# Altium schematic sheet 4_Load_Cell_Acquisition.SchDoc
size A3; Organization: Altium Limited; Address1: L3, 12a Rodborough Rd; Address2: Frenchs Forest; Address3: NSW; Address4: Australia 2086; SheetNumber: 4; SheetTotal: 8
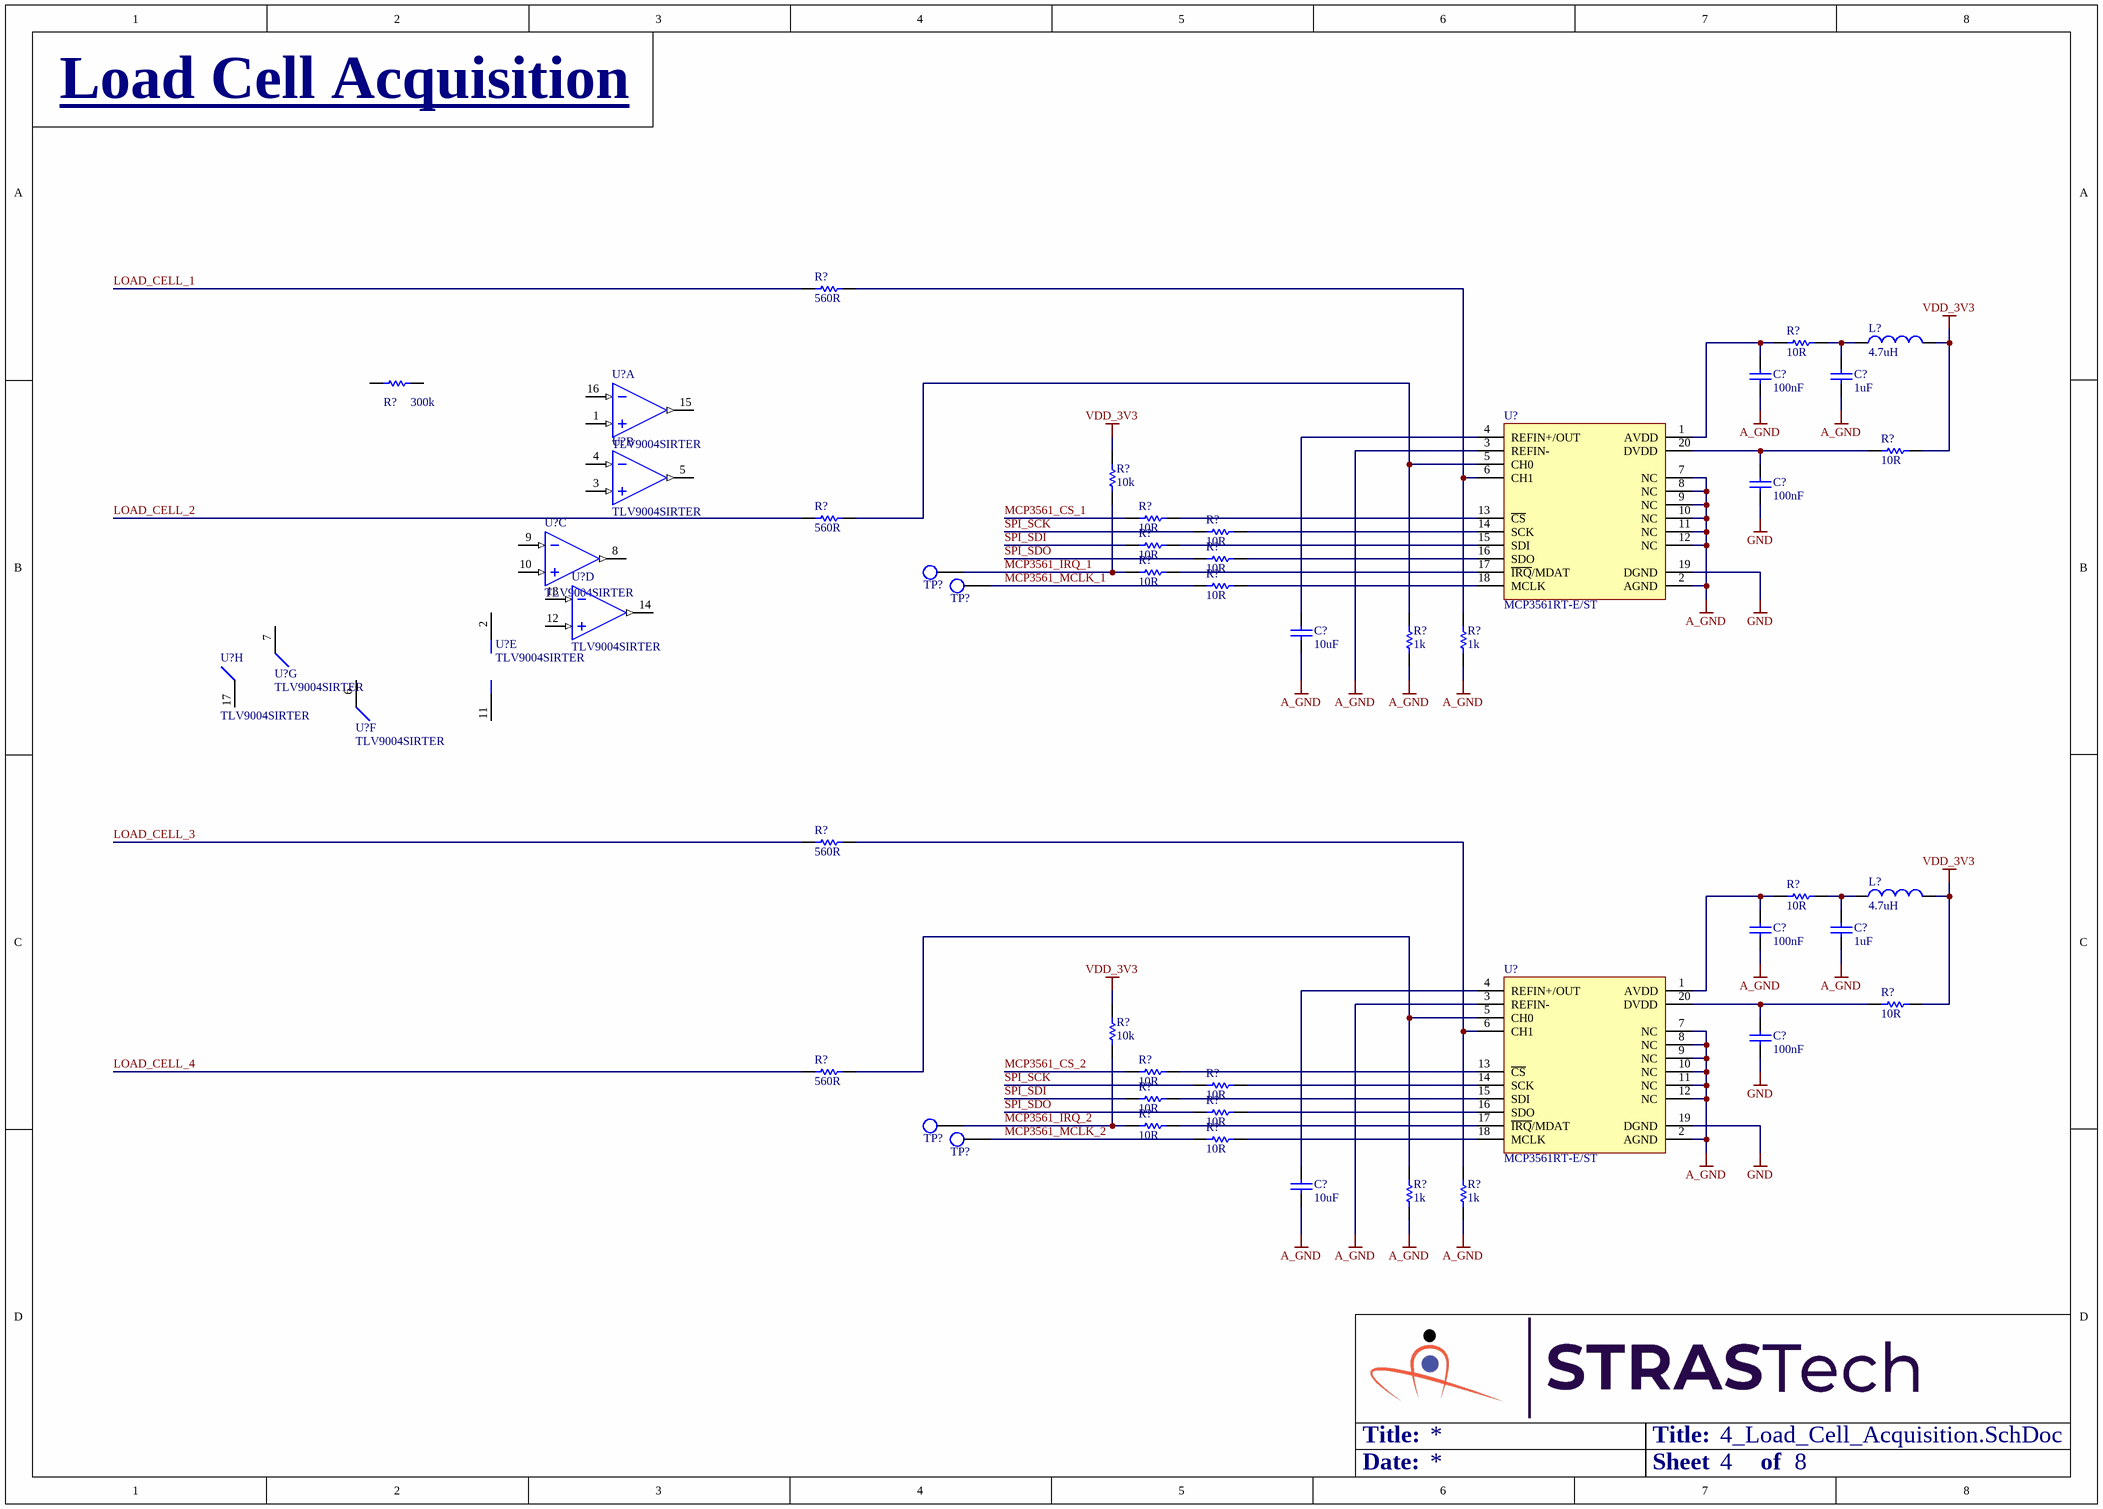
[diagram p0: 4_Load_Cell_Acquisition.SchDoc]

## Parts
(Parts that share a designator on the sheet are numbered #1, #2 ... from top to bottom, then left to right.)
C?#1  100nF  [Cap,SMD,0402]
C?#2  1uF  [Cap,SMD,0402]
C?#3  100nF  [Cap,SMD,0402]
C?#4  10uF  [Cap,SMD,0402]
C?#5  100nF  [Cap,SMD,0402]
C?#6  1uF  [Cap,SMD,0402]
C?#7  100nF  [Cap,SMD,0402]
C?#8  10uF  [Cap,SMD,0402]
L?#1  4.7uH  [IND,0805]
L?#2  4.7uH  [IND,0805]
R?#1  560R  [RES,0402]
R?#2  10R  [RES,0402]
R?#3  300k  [RES,0402]
R?#4  10R  [RES,0402]
R?#5  10k  [RES,0402]
R?#6  560R  [RES,0402]
R?#7  10R  [RES,0402]
R?#8  10R  [RES,0402]
R?#9  10R  [RES,0402]
R?#10  10R  [RES,0402]
R?#11  10R  [RES,0402]
R?#12  10R  [RES,0402]
R?#13  1k  [RES,0402]
R?#14  1k  [RES,0402]
R?#15  560R  [RES,0402]
R?#16  10R  [RES,0402]
R?#17  10R  [RES,0402]
R?#18  10k  [RES,0402]
R?#19  560R  [RES,0402]
R?#20  10R  [RES,0402]
R?#21  10R  [RES,0402]
R?#22  10R  [RES,0402]
R?#23  10R  [RES,0402]
R?#24  10R  [RES,0402]
R?#25  10R  [RES,0402]
R?#26  1k  [RES,0402]
R?#27  1k  [RES,0402]
TP?#1  TESTPOINT  [testpoint,smd,round,1mm]  (value not drawn)
TP?#2  TESTPOINT  [testpoint,smd,round,1mm]  (value not drawn)
TP?#3  TESTPOINT  [testpoint,smd,round,1mm]  (value not drawn)
TP?#4  TESTPOINT  [testpoint,smd,round,1mm]  (value not drawn)
U?#1  TLV9004SIRTER  [IC,QFN-16,3x3]  (part A of 8)
U?#2  MCP3561RT-E/ST  [IC,TSSOP-20,W4.4]
U?#3  TLV9004SIRTER  [IC,QFN-16,3x3]  (part B of 8)
U?#4  TLV9004SIRTER  [IC,QFN-16,3x3]  (part C of 8)
U?#5  TLV9004SIRTER  [IC,QFN-16,3x3]  (part D of 8)
U?#6  TLV9004SIRTER  [IC,QFN-16,3x3]  (part H of 8)
U?#7  TLV9004SIRTER  [IC,QFN-16,3x3]  (part E of 8)
U?#8  TLV9004SIRTER  [IC,QFN-16,3x3]  (part G of 8)
U?#9  TLV9004SIRTER  [IC,QFN-16,3x3]  (part F of 8)
U?#10  MCP3561RT-E/ST  [IC,TSSOP-20,W4.4]

## Nets
A_GND: C?#1.1 C?#2.1 C?#4.1 C?#5.1 C?#6.1 C?#8.1 R?#13.2 R?#14.2 R?#26.2 R?#27.2 U?#2.2(AGND) U?#2.3(REFIN-) U?#2.7(NC) U?#2.8(NC) U?#2.9(NC) U?#2.10(NC) U?#2.11(NC) U?#2.12(NC) U?#10.2(AGND) U?#10.3(REFIN-) U?#10.7(NC) U?#10.8(NC) U?#10.9(NC) U?#10.10(NC) U?#10.11(NC) U?#10.12(NC)
GND: C?#3.1 C?#7.1 U?#2.19(DGND) U?#10.19(DGND)
VDD_3V3: L?#1.2 L?#2.2 R?#4.2 R?#5.2 R?#17.2 R?#18.2
LOAD_CELL_1: R?#1.2
LOAD_CELL_2: R?#6.2
LOAD_CELL_3: R?#15.2
LOAD_CELL_4: R?#19.2
MCP3561_CS_1: R?#7.1
MCP3561_CS_2: R?#20.1
MCP3561_IRQ_1: R?#5.1 R?#11.1 TP?#1.1(TP)
MCP3561_IRQ_2: R?#18.1 R?#24.1 TP?#3.1(TP)
MCP3561_MCLK_1: R?#12.1 TP?#2.1(TP)
MCP3561_MCLK_2: R?#25.1 TP?#4.1(TP)
SPI_SCK: R?#8.1 R?#21.1
SPI_SDI: R?#9.1 R?#22.1
SPI_SDO: R?#10.1 R?#23.1
NetC?#1_2: C?#1.2 R?#2.1 U?#2.1(AVDD)
NetC?#2_2: C?#2.2 L?#1.1 R?#2.2
NetC?#3_2: C?#3.2 R?#4.1 U?#2.20(DVDD)
NetC?#4_2: C?#4.2 U?#2.4(REFIN+/OUT)
NetC?#5_2: C?#5.2 R?#16.1 U?#10.1(AVDD)
NetC?#6_2: C?#6.2 L?#2.1 R?#16.2
NetC?#7_2: C?#7.2 R?#17.1 U?#10.20(DVDD)
NetC?#8_2: C?#8.2 U?#10.4(REFIN+/OUT)
NetR?#1_1: R?#1.1 R?#14.1 U?#2.6(CH1)
NetR?#6_1: R?#6.1 R?#13.1 U?#2.5(CH0)
NetR?#7_2: R?#7.2 U?#2.13(~{CS})
NetR?#8_2: R?#8.2 U?#2.14(SCK)
NetR?#9_2: R?#9.2 U?#2.15(SDI)
NetR?#10_2: R?#10.2 U?#2.16(SDO)
NetR?#11_2: R?#11.2 U?#2.17(~{IRQ}/MDAT)
NetR?#12_2: R?#12.2 U?#2.18(MCLK)
NetR?#15_1: R?#15.1 R?#27.1 U?#10.6(CH1)
NetR?#19_1: R?#19.1 R?#26.1 U?#10.5(CH0)
NetR?#20_2: R?#20.2 U?#10.13(~{CS})
NetR?#21_2: R?#21.2 U?#10.14(SCK)
NetR?#22_2: R?#22.2 U?#10.15(SDI)
NetR?#23_2: R?#23.2 U?#10.16(SDO)
NetR?#24_2: R?#24.2 U?#10.17(~{IRQ}/MDAT)
NetR?#25_2: R?#25.2 U?#10.18(MCLK)

Not connected (* = marked no-connect by the designer): R?#3 1 2; U?#1 1(IN1+) 15(OUT1) 16(IN1-); U?#3 3(IN2+) 4(IN2-) 5(OUT2); U?#4 8(OUT3) 9(IN3-) 10(IN3+); U?#5 12(IN4+) 13(IN4-) 14(OUT4); U?#6 17(PAD); U?#7 2(V+) 11(V-); U?#8 7(~{SHDN}34); U?#9 6(~{SHDN}12)

## Notes on the sheet
- Load Cell Acquisition
- Title:
- Date:
- Sheet
- of
- Title
- Size:
- A3
- Revision:
- Design By:

## Library data of the parts
C?#1 C?#3 C?#5 C?#7 = CAP,Cer,100nF,25VDC,X7R,0402: 0.1µF ±10% 25V Ceramic Capacitor X7R 0402 (1005 Metric); Vendor Part Number: 490-14603-1-ND; Manufacturer: Murata Electronics; Manufacturer Part Number: GRM155R71E104KE14J; Vendor: Digikey; HelpURL: https://search.murata.co.jp/Ceramy/image/img/A01X/G101/ENG/GRM155R71E104KE14-01.pdf; CreatedBy: Judd Foster
C?#2 C?#6 = CAP,Cer,1uF,35VDC,X5R,0402: 1 µF ±10% 35V Ceramic Capacitor X5R 0402 (1005 Metric); Vendor Part Number: 445-9073-1-ND; Manufacturer: TDK Corporation; Manufacturer Part Number: C1005X5R1V105K050BC; Vendor: Digikey; HelpURL: https://product.tdk.com/info/en/catalog/datasheets/mlcc_commercial_general_en.pdf?ref_disty=digikey; CreatedBy: Judd Foster
C?#4 C?#8 = CAP,Cer,10uF,10VDC,X5R,0402: 10 µF ±20% 10V Ceramic Capacitor X5R 0402 (1005 Metric); Vendor Part Number: 1276-1450-1-ND; Manufacturer: Samsung Electro-Mechanics; Manufacturer Part Number: CL05A106MP5NUNC; Vendor: Digikey; HelpURL: https://media.digikey.com/pdf/Data%20Sheets/Samsung%20PDFs/CL05A106MP5NUNC_Spec.pdf; CreatedBy: Judd Foster
L?#1 L?#2 = IND,4.7uH,80mA,Multilayer,0805: 4.7 µH Shielded Multilayer Inductor 80 mA 300mOhm 0805 (2012 Metric); Vendor Part Number: 445-3169-1-ND; Manufacturer: TDK Corporation; Manufacturer Part Number: MLZ2012E4R7MT000; Vendor: Digikey; HelpURL: https://product.tdk.com/en/system/files?file=dam/doc/product/inductor/inductor/smd/catalog/inductor_commercial_decoupling_mlz2012_en.pdf; CreatedBy: Judd Foster
R?#1 R?#6 R?#15 R?#19 = RES,560R,1%,0.063W,0402: 560 Ohms ±1% 0.063W, 1/16W Chip Resistor 0402 (1005 Metric) Automotive AEC-Q200, Moisture Resistant Thick Film; Manufacturer: TE Connectivity Passive Product; Manufacturer Part Number: CRGCQ0402F560R; Vendor Part Number: A129624CT-ND; Vendor: Digikey; CreatedBy: Judd Foster; HelpURL: https://www.te.com/commerce/DocumentDelivery/DDEController?Action=srchrtrv&DocNm=1773204-3&DocType=DS&DocLang=English
R?#2 R?#4 R?#7-R?#12 R?#16 R?#17 R?#20-R?#25 = RES,10R,1%,0.063W,0402: 10 Ohms ±1% 0.063W, 1/16W Chip Resistor 0402 (1005 Metric) Automotive AEC-Q200 Thick Film; Manufacturer: Panasonic Electronic Components; Manufacturer Part Number: ERJ-2RKF10R0X; Vendor Part Number: P10.0LCT-ND; Vendor: Digikey; CreatedBy: Judd Foster; HelpURL: https://industrial.panasonic.com/cdbs/www-data/pdf/RDA0000/AOA0000C304.pdf
R?#3 = RES,300k,1%,0.063W,0402: 300 kOhms ±1% 0.063W, 1/16W Chip Resistor 0402 (1005 Metric) Automotive AEC-Q200 Thick Film; Manufacturer: Stackpole Electronics Inc; Manufacturer Part Number: RMCF0402FT300K; Vendor Part Number: RMCF0402FT300KCT-ND; Vendor: Digikey; CreatedBy: Judd Foster; HelpURL: https://www.seielect.com/catalog/sei-rmcf_rmcp.pdf
R?#5 R?#18 = RES,10k,5%,0.063W,0402: 10 kOhms ±5% 0.063W, 1/16W Chip Resistor 0402 (1005 Metric) Automotive AEC-Q200 Thick Film; Vendor Part Number: RMCF0402JT10K0CT-ND; Manufacturer: Stackpole Electronics Inc; Manufacturer Part Number: RMCF0402JT10K0; Vendor: DIgikey; HelpURL: https://www.seielect.com/catalog/sei-rmcf_rmcp.pdf; CreatedBy: Judd Foster
R?#13 R?#14 R?#26 R?#27 = RES,1k,5%,0.063W,0402: 1 kOhms ±5% 0.063W, 1/16W Chip Resistor 0402 (1005 Metric) Automotive AEC-Q200 Thick Film; Vendor Part Number: RMCF0402JT1K00CT-ND; Manufacturer: Stackpole Electronics Inc; Manufacturer Part Number: RMCF0402JT1K00; Vendor: DIgikey; HelpURL: https://www.seielect.com/catalog/sei-rmcf_rmcp.pdf; CreatedBy: Judd Foster
TP?#1-TP?#4 = TESTPOINT: PCB Testpoint; CreatedBy: Judd Foster; HelpURL: N/A; Manufacturer: N/A; Manufacturer Part Number: N/A; Vendor: N/A; Vendor Part Number: N/A
U?#1 U?#3-U?#9 = TLV9004SIRTER: General Purpose Amplifier 4 Circuit Rail-to-Rail 16-WQFN (3x3); Manufacturer: Texas Instruments; Vendor Part Number: 296-51829-1-ND; Vendor: Digikey; CreatedBy: Judd Foster; HelpURL: https://www.ti.com/general/docs/suppproductinfo.tsp?distId=10&gotoUrl=https%3A%2F%2Fwww.ti.com%2Flit%2Fgpn%2Ftlv9004; Manufacturer Part Number: TLV9004SIRTER
U?#2 U?#10 = MCP3561RT-E/ST: 24 Bit Analog to Digital Converter 1 Input 1 Sigma-Delta 20-TSSOP; Vendor Part Number: 150-MCP3561RT-E/STCT-ND; Manufacturer: Microchip Technology; Vendor: Digikey; Manufacturer Part Number: MCP3561RT-E/ST; HelpURL: https://ww1.microchip.com/downloads/en/DeviceDoc/MCP3561.2.4R-Data-Sheet-DS200006391A.pdf; CreatedBy: Judd Foster